# Altium schematic sheet MCBSupply.SchDoc
size A
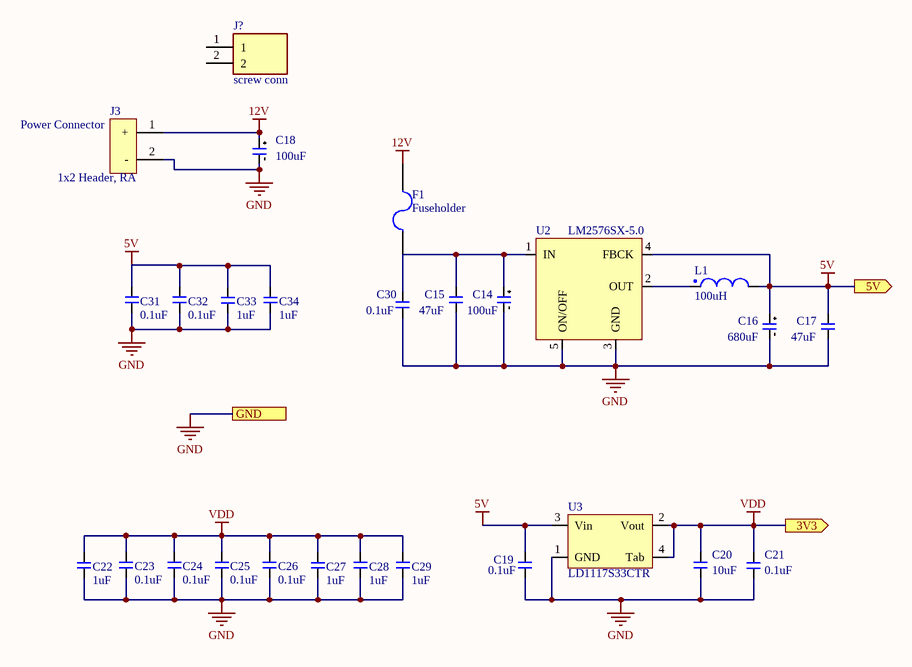
[diagram p0: MCBSupply.SchDoc]

## Parts
C14  100uF  [UCY2C101MHD1TO]
C15  47uF  [C0805]
C16  680uF  [EEE-FP1C681AP]
C17  47uF  [C0805]
C18  100uF  [UCY2C101MHD1TO]
C19  0.1uF  [C0805]
C20  10uF  [C0805]
C21  0.1uF  [C0805]
C22  1uF  [C0805]
C23  0.1uF  [C0805]
C24  0.1uF  [C0805]
C25  0.1uF  [C0805]
C26  0.1uF  [C0805]
C27  1uF  [C0805]
C28  1uF  [C0805]
C29  1uF  [C0805]
C30  0.1uF  [C0805]
C31  0.1uF  [C0805]
C32  0.1uF  [C0805]
C33  1uF  [C0805]
C34  1uF  [C0805]
F1  Fuseholder  [SCHURTER - 0031.7701.11 - FUSE HOLDER, PCB MOUNT]
J3  1x2 Header, RA  [Right Angle Header 43650-0205(Primary)]
J?  screw conn  [282837-2]
L1  100uH  [7447709101]
U2  LM2576SX-5.0  [TO263-5]
U3  LD1117S33CTR  [SOT-233]

## Ports
3V3 (out), 5V (out), GND

## Nets
5V: C16.1 C17.1 C19.2 C31.2 C32.2 C33.2 C34.2 L1.2 U2.4(FBCK) U3.3(Vin) ; port 5V
12V: C18.1 F1.2 J3.1(+)
GND: C14.2 C15.2 C16.2 C17.2 C18.2 C19.1 C20.1 C21.1 C22.1 C23.1 C24.1 C25.1 C26.1 C27.1 C28.1 C29.1 C30.1 C31.1 C32.1 C33.1 C34.1 J3.2(-) U2.3(GND) U2.5(ON/OFF) U3.1(GND) ; port GND
VDD: C20.2 C21.2 C22.2 C23.2 C24.2 C25.2 C26.2 C27.2 C28.2 C29.2 U3.2(Vout) U3.4(Tab) ; port 3V3
NetC14_1: C14.1 C15.1 C30.2 F1.1 U2.1(IN)
NetL1_1: L1.1 U2.2(OUT)

Not connected (* = marked no-connect by the designer): J? 1 2; U2 6(TAB)

## Notes on the sheet
- (near J3) Power Connector

## Library data of the parts
C14 C18 = UCY2C101MHD1TO: CAP ALUM 100UF 20% 160V RADIAL; Capacitance: 9pF; Voltage Rating: 100V; Dielectric: C0G; RoHS: Yes; Mount: Surface Mount; Case/Package: 0805; Weight: 0.000194oz; Case Code (Imperial): 0805; Case Code (Metric): 2012; Min Operating Temperature: -55°C; Max Operating Temperature: 125°C; Packaging: Tape and Reel; Package Quantity: 4000; Voltage Rating (DC): 100V; Termination: SMD/SMT; Length: 2.01mm; Width: 1.25mm; Thickness: 0.037inch; Depth: 1.25mm; Radiation Hardening: No; ComponentLink1Description: https://www.digikey.ca/product-detail/en/nichicon/UCY2C101MHD1TO/493-4784-1-ND/3129121; ComponentLink1URL: https://www.digikey.ca/product-detail/en/nichicon/UCY2C101MHD1TO/493-4784-1-ND/3129121; Supplier 1: Digi-Key; Supplier Part Number 1: 493-4784-1-ND
C15 C17 = GRM21BR61A476ME15L: CAP CER 47UF 10V X5R 0805; Capacitance: 4.7uF; Tolerance: 80%; Dielectric: Y5V; RoHS: Yes; Mount: Surface Mount; Case/Package: 0805; Number of Pins: 2; Case Code (Metric): 2012; Case Code (Imperial): 0805; Min Operating Temperature: -30°C; Max Operating Temperature: 85°C; Package Quantity: 1; Voltage Rating: 10V; Packaging: Tape and Reel; Voltage Rating (DC): 10V; Termination: SMD/SMT; Composition: Ceramic; Length: 2mm; Height: 0.85mm; Width: 0.049inch; Thickness: 0.033inch; Depth: 1.25mm; Radiation Hardening: No; REACH SVHC: Unknown; Lead Free: Lead Free; Halogen Free: Halogen Free; Supplier 1: Digi-Key; Supplier Part Number 1: 490-9961-1-ND
C16 = EEE-FP1C681AP: CAP ALUM 680UF 20% 16V SMD; Capacitance: 9pF; Voltage Rating: 100V; Dielectric: C0G; RoHS: Yes; Mount: Surface Mount; Case/Package: 0805; Weight: 0.000194oz; Case Code (Imperial): 0805; Case Code (Metric): 2012; Min Operating Temperature: -55°C; Max Operating Temperature: 125°C; Packaging: Tape and Reel; Package Quantity: 4000; Voltage Rating (DC): 100V; Termination: SMD/SMT; Length: 2.01mm; Width: 1.25mm; Thickness: 0.037inch; Depth: 1.25mm; Radiation Hardening: No; ComponentLink1Description: https://www.digikey.ca/product-detail/en/panasonic-electronic-components/EEE-FP1C681AP/PCE4437CT-ND/1246017; ComponentLink1URL: https://www.digikey.ca/product-detail/en/panasonic-electronic-components/EEE-FP1C681AP/PCE4437CT-ND/1246017; Supplier 1: Digi-Key; Supplier Part Number 1: PCE4437CT-ND
C19 C21 C23-C26 C30-C32 = CL21B104KBCWPNC: CAP CER 0.1UF 50V X7R 0805; Manufacturer: Samsung; Capacitance: 100nF; Tolerance: 10%; Supplier 1: Digi-Key; Supplier Part Number 1: 1276-6557-1-ND; Manufacturer Part Number: CL21B104KBCWPNC; Stock 1: 6545; Pricing 1: 1 = 0.10000, 10 = 0.06700, 100 = 0.02990, 500 = 0.02138, 1000 = 0.01680 (USD); RoHS: Yes; Mount: Surface Mount; Case/Package: 0805; Case Code (Metric): 2012; Case Code (Imperial): 0805; Min Operating Temperature: -55°C; Max Operating Temperature: 125°C; Packaging: Tape and Reel; Voltage Rating: 50V; Features: Soft Termination; Length: 0.079inch; Width: 0.049inch; Thickness: 0.053inch; Ratings: AEC-Q200; Category: Capacitors
C20 = C0805C106K8PACTU: CAP CER 10UF 10V X5R 0805; Manufacturer: Samsung; Manufacturer Part Number: CL21B105KAFNNNE; Capacitance: 1uF; Tolerance: 10%; Voltage Rating: 25V; Dielectric: X7R; RoHS: Yes; Mount: Surface Mount; Case/Package: 0805; Contact Plating: Tin; Case Code (Metric): 2012; Case Code (Imperial): 0805; Min Operating Temperature: -55°C; Max Operating Temperature: 125°C; Packaging: Tape and Reel; Package Quantity: 1; Voltage: 25V; Voltage Rating (DC): 25V; Length: 2mm; Height: 1.25mm; Depth: 1.25mm; Width: 0.049inch; Thickness: 0.053inch; Radiation Hardening: No; Lead Free: Lead Free; Category: Capacitors; ComponentLink1Description: https://www.digikey.ca/product-detail/en/kemet/C0805C106K8PACTU/399-4925-1-ND/1090920; ComponentLink1URL: https://www.digikey.ca/product-detail/en/kemet/C0805C106K8PACTU/399-4925-1-ND/1090920; Supplier 1: Digi-Key; Supplier Part Number 1: 399-4925-1-ND
C22 C27-C29 C33 C34 = CL21B105KAFNNNE: Cap Ceramic 1uF 25V X7R 10% SMD 0805 125C T/R; Manufacturer: Samsung; Supplier 1: Digi-Key; Supplier Part Number 1: 1276-1066-1-ND; Manufacturer Part Number: CL21B105KAFNNNE; Stock 1: 1606570; Pricing 1: 1 = 0.10000, 10 = 0.07600, 100 = 0.03380, 500 = 0.02416, 1000 = 0.01898 (USD); RoHS: Yes; Mount: Surface Mount; Case/Package: 0805; Contact Plating: Tin; Case Code (Metric): 2012; Case Code (Imperial): 0805; Min Operating Temperature: -55°C; Max Operating Temperature: 125°C; Packaging: Tape and Reel; Package Quantity: 1; Capacitance: 1uF; Tolerance: 10%; Voltage Rating: 25V; Dielectric: X7R; Voltage: 25V; Voltage Rating (DC): 25V; Length: 2mm; Height: 1.25mm; Depth: 1.25mm; Width: 0.049inch; Thickness: 0.053inch; Radiation Hardening: No; Lead Free: Lead Free; ComponentLink1URL: https://datasheet.ciiva.com/25800/cl21b105kafnnne-25800163.pdf?src-supplier=Digi-Key; ComponentLink1Description: https://datasheet.ciiva.com/25800/cl21b105kafnnne-25800163.pdf?src-supplier=Digi-Key; ComponentLink2URL: https://datasheet.ciiva.com/15195/getdatasheetpartid-355205-15195880.pdf?src-supplier=Verical; ComponentLink2Description: https://datasheet.ciiva.com/15195/getdatasheetpartid-355205-15195880.pdf?src-supplier=Verical; Category: Capacitors
F1 = 0031.7701.11: SCHURTER - 0031.7701.11 - FUSE HOLDER, PCB MOUNT; Color: White; Material: Tin; Body Material: Thermoplastic; Current Rating: 5A; Voltage Rating (AC): 125V; Number of Poles: 1; Illumination Type: Illuminated; Supplier 1: Digi-Key; Supplier Part Number 1: 486-1991-ND; Manufacturer: Schurter; Manufacturer Part Number: 0031.7701.11; Stock 1: 11381; Pricing 1: 1 = 1.39000, 50 = 1.03400, 100 = 0.93100, 500 = 0.70300, 1000 = 0.52080 (USD); RoHS: Yes; Mount: Surface Mount; Weight: 0.016932oz; Contact Material: Copper Alloy; Contact Plating: Tin; Terminal Material: Brass; Min Operating Temperature: -40°C; Max Operating Temperature: 85°C; Package Quantity: 100; Packaging: Bulk; Voltage Rating: 125V; Number of Circuits: 1; Termination: SMD/SMT; Voltage: 125V; Fuse Current: 5A; Voltage Rating (DC): 125V; Length: 12mm; Height: 6mm; Width: 5.2mm; Depth: 5.2mm; Radiation Hardening: No; REACH SVHC: No SVHC; Lead Free: Lead Free; ComponentLink1URL: https://datasheet.ciiva.com/1270/typ-omh-125-1270896.pdf?src-supplier=Element14; ComponentLink1Description: https://datasheet.ciiva.com/1270/typ-omh-125-1270896.pdf?src-supplier=Element14; ComponentLink2URL: https://datasheet.ciiva.com/7496/typ-omh-125-7496724.pdf?src-supplier=Digi-Key; ComponentLink2Description: https://datasheet.ciiva.com/7496/typ-omh-125-7496724.pdf?src-supplier=Digi-Key; ComponentLink3URL: https://datasheet.ciiva.com/16215/typ-omh-125-16215096.pdf?src-supplier=Onlinecomponents.com; ComponentLink3Description: https://datasheet.ciiva.com/16215/typ-omh-125-16215096.pdf?src-supplier=Onlinecomponents.com; ComponentLink4URL: https://datasheet.ciiva.com/30058/73typ-omh-125-30058618.pdf?src-supplier=Onlinecomponents.com; ComponentLink4Description: https://datasheet.ciiva.com/30058/73typ-omh-125-30058618.pdf?src-supplier=Onlinecomponents.com; ComponentLink5URL: https://datasheet.ciiva.com/14128/awomh125-data-e-14128364.pdf?src-supplier=Distrelec; ComponentLink5Description: https://datasheet.ciiva.com/14128/awomh125-data-e-14128364.pdf?src-supplier=Distrelec; ComponentLink6URL: https://datasheet.ciiva.com/1221/1925349-1221826.pdf?src-supplier=Newark; ComponentLink6Description: https://datasheet.ciiva.com/1221/1925349-1221826.pdf?src-supplier=Newark; ComponentLink7URL: https://datasheet.ciiva.com/3014/typ-omh-125-3014522.pdf?src-supplier=Avnet; ComponentLink7Description: https://datasheet.ciiva.com/3014/typ-omh-125-3014522.pdf?src-supplier=Avnet; ComponentLink8URL: https://datasheet.ciiva.com/4480/typ-omh-125-4480427.pdf?src-supplier=Mouser; ComponentLink8Description: https://datasheet.ciiva.com/4480/typ-omh-125-4480427.pdf?src-supplier=Mouser; ComponentLink9URL: https://datasheet.ciiva.com/17405/typ-omh-125-17405484.pdf?src-supplier=Avnet+Europe; ComponentLink9Description: https://datasheet.ciiva.com/17405/typ-omh-125-17405484.pdf?src-supplier=Avnet+Europe; Category: Circuit Protection; ComponentLink10Description: Digikey; ComponentLink10URL: https://www.digikey.ca/product-detail/en/schurter-inc/0031.7701.11/486-1991-ND/640027
J3 = 43650-0205: HEADER, RIGHT ANGLE, 2WAY; Manufacturer: Molex; Number of Positions: 2; Voltage Rating: 600V; Current Rating: 5A; Gender: Male; Pitch: 3mm; Glow Wire Compliant: Compliant; Supplier 1: Digi-Key; Supplier Part Number 1: WM17581-ND; Manufacturer Part Number: 43650-0205; Stock 1: 2695; Pricing 1: 1 = 1.44000, 10 = 1.30500, 100 = 1.11870, 500 = 0.93222, 3927 = 0.74578, 7854 = 0.70849, 11781 = 0.69251 (USD); RoHS: Yes; Contact Material: Brass; Contact Plating: Gold; Housing Material: Thermoplastic; Number of Rows: 1; Packaging: Tray; Termination: Through Hole; Number of Contacts: 2; Orientation: Right Angle; Package Quantity: 3927; Number of Circuits: 2; Halogen Free: Low Halogen; ComponentLink1URL: http://www.farnell.com/cad/153635.pdf?src-supplier=Element14; ComponentLink1Description: http://www.farnell.com/cad/153635.pdf?src-supplier=Element14; ComponentLink2URL: http://www.molex.com/webdocs/datasheets/pdf/en-us/0436500205_PCB_HEADERS.pdf?src-supplier=Avnet; ComponentLink2Description: http://www.molex.com/webdocs/datasheets/pdf/en-us/0436500205_PCB_HEADERS.pdf?src-supplier=Avnet; ComponentLink3URL: http://www.molex.com/webdocs/datasheets/pdf/en-us/0436500205_PCB_HEADERS.pdf?src-supplier=Avnet+Europe; ComponentLink3Description: http://www.molex.com/webdocs/datasheets/pdf/en-us/0436500205_PCB_HEADERS.pdf?src-supplier=Avnet+Europe; ComponentLink4URL: http://www.mouser.com/ds/2/276/0436500205_PCB_HEADERS-148686.pdf?src-supplier=Mouser; ComponentLink4Description: http://www.mouser.com/ds/2/276/0436500205_PCB_HEADERS-148686.pdf?src-supplier=Mouser; Category: Connectors; ComponentLink5Description: Digikey; ComponentLink5URL: https://www.digikey.com/products/en?WT.z_cid=sp_900_0310_buynow&keywords=436500205
J? = 282837-2: CONN SCREW 2POS; Manufacturer 1: TE Connectivity; Plating: Brass; Number of Levels: 1; Number of Positions Per Level: 2; Current: 13.5A; Voltage: 300V; Closed End: No (Without); Interlock: Yes (With); Connector Type: Receptacle; Voltage Rating: 250V; Gender: Female; Pitch: 5.08mm; Wire Gauge (Max): 28AWG; Wire Gauge (Min): 16AWG; Tail Length: 3.5mm; Thread Size: M3; Wire/Cable Gauge: 30AWG; Approvals: UL; Supplier 1: Digi-Key; Manufacturer Part Number 1: 282837-2; Stock 1: 129828; Pricing 1: 1=1.04000, 10=0.64700, 25=0.55400, 50=0.49780, 100=0.48750, 250=0.41492, 500=0.39416, 1000=0.35267, 5000=0.27591 (USD); RoHS: Yes; Mount: Through Hole; Color: Green; Housing Color: Green; Housing Material: Polyamide; Contact Plating: Tin; Contact Material: Brass; Termination: Solder; Orientation: Straight; Packaging: Bulk; Number of Contacts: 2; Number of Rows: 1; Package Quantity: 300; Number of Positions: 2; Number of Circuits: 2; Current Rating: 13.5A; Screw Flange: No (Without); Screwless Terminal Block: No (Without); Side Stackable: Yes (With); Max Current Rating: 13.5A; Max Voltage Rating (AC): 250V; Max Supply Voltage (AC): 250V; Voltage Rating (AC): 250V; Number of Poles: 2; Length: 10.76mm; Height: 11.5mm; Depth: 8.2mm; Width: 11.5mm; Radiation Hardening: No; Flammability Rating: UL94 V-0; ELV: Compliant; Lead Free: Lead Free; REACH SVHC: Unknown; ComponentLink1URL: https://datasheet.ciiva.com/819/eng-cs-1308389-eurostyle-terminal-blocks-0607-819104.pdf?src-supplier=Avnet; ComponentLink1Description: https://datasheet.ciiva.com/819/eng-cs-1308389-eurostyle-terminal-blocks-0607-819104.pdf?src-supplier=Avnet; ComponentLink2URL: https://datasheet.ciiva.com/19467/750688-19467564.pdf?src-supplier=Jameco; ComponentLink2Description: https://datasheet.ciiva.com/19467/750688-19467564.pdf?src-supplier=Jameco; ComponentLink3URL: https://datasheet.ciiva.com/16305/eng-cs-1308389-eurostyle-terminal-blocks-0607-16305248.pdf?src-supplier=Future+Electronics; ComponentLink3Description: https://datasheet.ciiva.com/16305/eng-cs-1308389-eurostyle-terminal-blocks-0607-16305248.pdf?src-supplier=Future+Electronics; ComponentLink4URL: https://datasheet.ciiva.com/11758/0900766b80e7dc97-11758677.pdf?src-supplier=RSComponents; ComponentLink4Description: https://datasheet.ciiva.com/11758/0900766b80e7dc97-11758677.pdf?src-supplier=RSComponents; ComponentLink5URL: https://datasheet.ciiva.com/7978/1650926-7978569.pdf?src-supplier=Element14; ComponentLink5Description: https://datasheet.ciiva.com/7978/1650926-7978569.pdf?src-supplier=Element14; ComponentLink6URL: https://datasheet.ciiva.com/14606/70086281-14606908.pdf?src-supplier=Allied+Electronics; ComponentLink6Description: https://datasheet.ciiva.com/14606/70086281-14606908.pdf?src-supplier=Allied+Electronics; ComponentLink7URL: https://datasheet.ciiva.com/30084/eng-cs-1308389-eurostyle-terminal-blocks-0607-30084269.pdf?src-supplier=Onlinecomponents.com; ComponentLink7Description: https://datasheet.ciiva.com/30084/eng-cs-1308389-eurostyle-terminal-blocks-0607-30084269.pdf?src-supplier=Onlinecomponents.com; ComponentLink8URL: https://datasheet.ciiva.com/16649/eng-cs-1308389-eurostyle-terminal-blocks-0607-16649391.pdf?src-supplier=Avnet+Europe; ComponentLink8Description: https://datasheet.ciiva.com/16649/eng-cs-1308389-eurostyle-terminal-blocks-0607-16649391.pdf?src-supplier=Avnet+Europe; ComponentLink9URL: https://datasheet.ciiva.com/18620/eng-cd-282837-g3-18620917.pdf?src-supplier=Digi-Key; ComponentLink9Description: https://datasheet.ciiva.com/18620/eng-cd-282837-g3-18620917.pdf?src-supplier=Digi-Key; ComponentLink10URL: https://datasheet.ciiva.com/823/eng-cd-282837-g3-823439.pdf?src-supplier=Digi-Key; ComponentLink10Description: https://datasheet.ciiva.com/823/eng-cd-282837-g3-823439.pdf?src-supplier=Digi-Key; Supplier Part Number 1: A113320-ND
L1 = 7447709101: FIXED IND 100UH 2.5A 110 MOHM; Material: Ferrite; Impedance: 300mR; Current Rating: 500mA; Number of Lines: 1; Test Frequency: 100MHz; Resistance: 950R; Shielding: Unshielded; RoHS: Yes; Mount: Surface Mount; Case/Package: 1206; Case Code (Metric): 3216; Case Code (Imperial): 1206; Min Operating Temperature: -40°C; Max Operating Temperature: 125°C; Package Quantity: 1; Packaging: Tape and Reel; Max Current Rating: 500mA; DC Resistance (DCR): 300mR; Max DC Current: 500mA; Termination: SMD/SMT; Length: 3.2mm; Height: 0.051inch; Width: 0.063inch; Depth: 1.8mm; Lead Free: Lead Free; ComponentLink1Description: https://www.digikey.ca/product-detail/en/w-rth-elektronik/7447709101/732-1248-1-ND/1639309; ComponentLink1URL: https://www.digikey.ca/product-detail/en/w-rth-elektronik/7447709101/732-1248-1-ND/1639309; Supplier 1: Digi-Key; Supplier Part Number 1: 732-1248-1-ND
U2 = LM2576SX-5.0: IC REG BUCK 5V 3A TO263-5; Supplier 1: Digi-Key; Supplier Part Number 1: LM2576SX-5.0/NOPBCT-ND
U3 = LD1117S33CTR: IC REG LINEAR 3.3V 800MA SOT223; Manufacturer 1: STMicroelectronics; Number of Outputs: 1; Output Current: 950mA; Min Input Voltage: 5.3V; Dropout Voltage: 1.1V; Max Output Current: 1.3A; Max Input Voltage: 15V; Max Power Dissipation: 12W; Input Bias Current: 5mA; Polarity: Positive; Quiescent Current: 10mA; Accuracy: 1%; Output Type: Fixed; Supplier 1: Digi-Key; Manufacturer Part Number 1: LD1117S33CTR; Stock 1: 43439; Pricing 1: 1=0.41000, 10=0.35100, 100=0.26180, 500=0.20570, 1000=0.15895 (USD); RoHS: Yes; Mount: Surface Mount; Case/Package: SOT-223; Number of Pins: 4; Weight: 0.01lb; Number of Terminals: 4; Contact Plating: Tin,Matte; Min Operating Temperature: -40°C; Max Operating Temperature: 125°C; Output Voltage: 3.3V; Packaging: Tape and Reel; Nominal Output Voltage: 3.3V; Package Quantity: 1; Max Supply Voltage: 15V; Min Supply Voltage: 3.3V; Number of Regulators: 1; Min Output Voltage: 3.3V; Power Dissipation: 12W; Max Output Voltage: 3.3V; Termination: SMD/SMT; Output Voltage Accuracy: 1%; Length: 6.5mm; Height: 1.8mm; Width: 3.5mm; Radiation Hardening: No; REACH SVHC: No SVHC; Lead Free: Lead Free; ComponentLink1URL: https://datasheet.ciiva.com/19480/1390223-19480586.pdf?src-supplier=Jameco; ComponentLink1Description: https://datasheet.ciiva.com/19480/1390223-19480586.pdf?src-supplier=Jameco; ComponentLink2URL: https://datasheet.ciiva.com/1511/1776449-1511572.pdf?src-supplier=Element14; ComponentLink2Description: https://datasheet.ciiva.com/1511/1776449-1511572.pdf?src-supplier=Element14; ComponentLink3URL: https://datasheet.ciiva.com/16392/cd00000544-16392069.pdf?src-supplier=Future+Electronics; ComponentLink3Description: https://datasheet.ciiva.com/16392/cd00000544-16392069.pdf?src-supplier=Future+Electronics; ComponentLink4URL: https://datasheet.ciiva.com/2041/cd00000544-2041932.pdf?src-supplier=Digi-Key; ComponentLink4Description: https://datasheet.ciiva.com/2041/cd00000544-2041932.pdf?src-supplier=Digi-Key; ComponentLink5URL: https://datasheet.ciiva.com/7992/1776449-7992620.pdf?src-supplier=Element14; ComponentLink5Description: https://datasheet.ciiva.com/7992/1776449-7992620.pdf?src-supplier=Element14; ComponentLink6URL: https://datasheet.ciiva.com/2041/cd00000544-2041933.pdf?src-supplier=Digi-Key; ComponentLink6Description: https://datasheet.ciiva.com/2041/cd00000544-2041933.pdf?src-supplier=Digi-Key; ComponentLink7URL: https://datasheet.ciiva.com/2041/cd00000544-2041934.pdf?src-supplier=Digi-Key; ComponentLink7Description: https://datasheet.ciiva.com/2041/cd00000544-2041934.pdf?src-supplier=Digi-Key; Supplier Part Number 1: 497-1241-1-ND